# Altium schematic sheet MCU_STM32F411CE.SchDoc
size B; DrawnBy: M.Rex; Engineer: MR; Organization: Expatria Technologies; Address1: 1136 Glade Court; Address2: Port Coquitlam, BC V3B 1R5; Address3: CANADA; DocumentNumber: 3; SheetNumber: 3; SheetTotal: 13
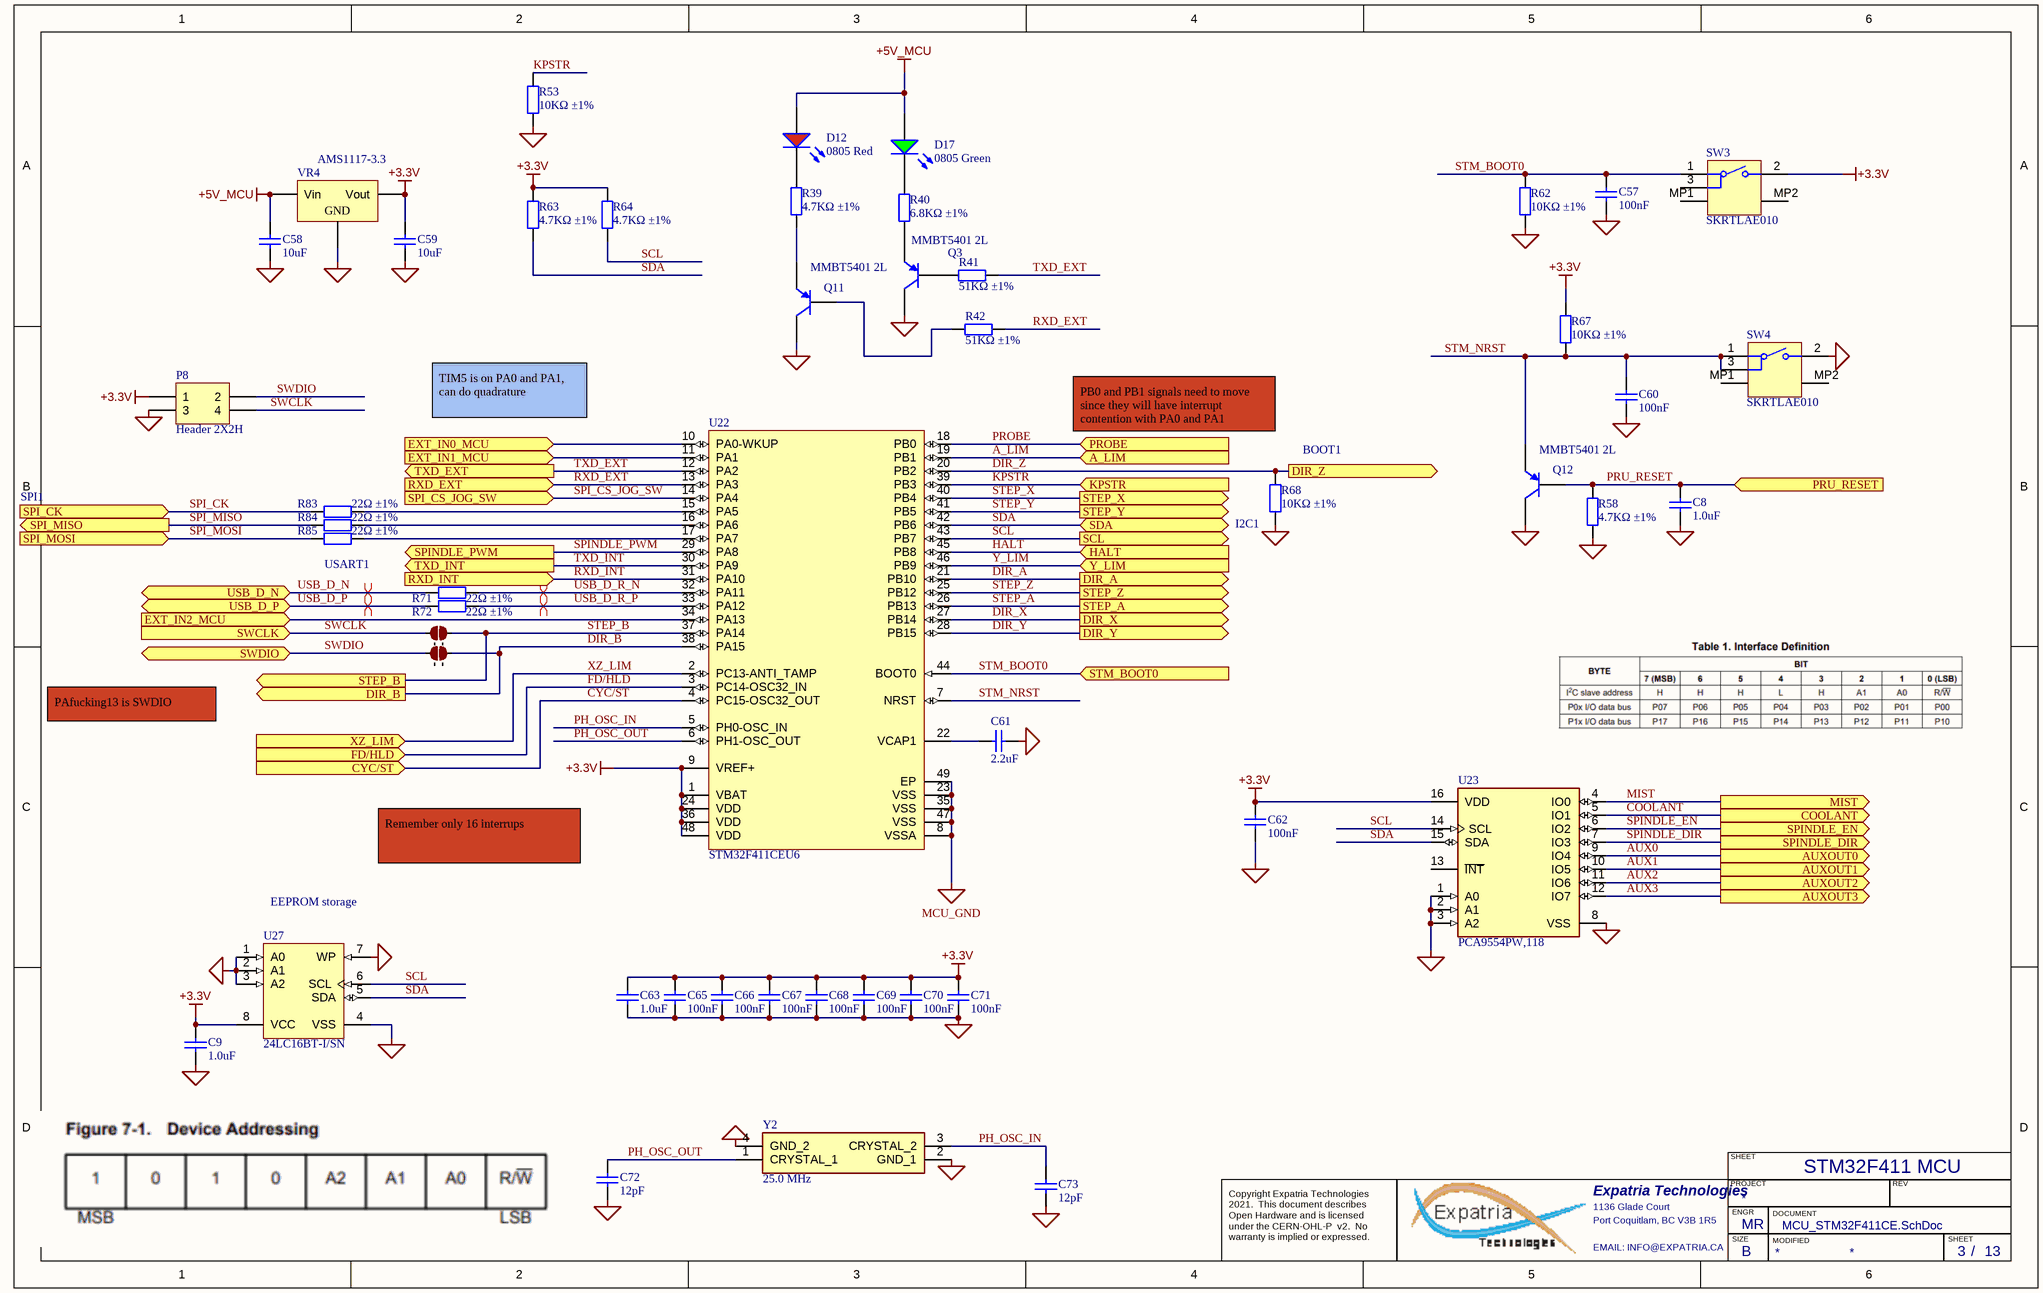
[diagram p0: MCU_STM32F411CE.SchDoc]

## Parts
C8  1.0uF  [0402_C]
C9  1.0uF  [0402_C]
C57  100nF  [0402_C]
C58  10uF  [1206_C]
C59  10uF  [1206_C]
C60  100nF  [0402_C]
C61  2.2uF  [0603_C]
C62  100nF  [0402_C]
C63  1.0uF  [0402_C]
C65  100nF  [0402_C]
C66  100nF  [0402_C]
C67  100nF  [0402_C]
C68  100nF  [0402_C]
C69  100nF  [0402_C]
C70  100nF  [0402_C]
C71  100nF  [0402_C]
C72  12pF  [0402_C]
C73  12pF  [0402_C]
D12  0805 Red  [0805_LED_S1]
D17  0805 Green  [0805_LED_S1]
J11  2 way net solder junction - Normally Open  [2waySolder_NO]  (value not drawn)  (no BOM)
J13  2 way net solder junction - Normally Open  [2waySolder_NO]  (value not drawn)  (no BOM)
P8  Header 2X2H  [HDR2X2H]
Q3  MMBT5401 2L  [SOT-23(SOT-23-3)]
Q11  MMBT5401 2L  [SOT-23(SOT-23-3)]
Q12  MMBT5401 2L  [SOT-23(SOT-23-3)]
R39  4.7KΩ ±1%  [0402_R]
R40  6.8KΩ ±1%  [0402_R]
R41  51KΩ ±1%  [0402_R]
R42  51KΩ ±1%  [0402_R]
R53  10KΩ ±1%  [0402_R]
R58  4.7KΩ ±1%  [0402_R]
R62  10KΩ ±1%  [0402_R]
R63  4.7KΩ ±1%  [0402_R]
R64  4.7KΩ ±1%  [0402_R]
R67  10KΩ ±1%  [0402_R]
R68  10KΩ ±1%  [0402_R]
R71  22Ω ±1%  [0402_R]
R72  22Ω ±1%  [0402_R]
R83  22Ω ±1%  [0402_R]
R84  22Ω ±1%  [0402_R]
R85  22Ω ±1%  [0402_R]
SW3  SKRTLAE010  [ALPS-SKRTLAE010_V]
SW4  SKRTLAE010  [ALPS-SKRTLAE010_V]
U22  STM32F411CEU6  [STM-UFQFPN48_M]
U23  PCA9554PW,118  [FP-SOT403-1-IPC_C]
U27  24LC16BT-I/SN  [SOIC-SN8_L]
VR4  AMS1117-3.3  [SOT-223]
Y2  25.0 MHz  [YSX321SL]

## Ports
A_LIM (in), AUXOUT0 (out), AUXOUT1 (out), AUXOUT2 (out), AUXOUT3 (out), COOLANT (out), CYC/ST (in), DIR_A (out), DIR_B (out), DIR_X (out), DIR_Y (out), DIR_Z (out), EXT_IN0_MCU (in), EXT_IN1_MCU (in), EXT_IN2_MCU (in), FD/HLD (in), HALT (in), KPSTR (in), MIST (out), PROBE (in), PRU_RESET (in), RXD_EXT (in), RXD_INT (in), SCL (out), SDA (bidir), SPI_CK (in), SPI_CS_JOG_SW (in), SPI_MISO (out), SPI_MOSI (in), SPINDLE_DIR (out), SPINDLE_EN (out), SPINDLE_PWM (out), STEP_A (out), STEP_B (out), STEP_X (out), STEP_Y (out), STEP_Z (out), STM_BOOT0 (in), SWCLK (in), SWDIO (bidir), TXD_EXT (out), TXD_INT (out), USB_D_N (bidir), USB_D_P (bidir), XZ_LIM (in), Y_LIM (in)

## Nets
+3.3V: C9.2 C59.2 C62.2 C63.2 C65.2 C66.2 C67.2 C68.2 C69.2 C70.2 C71.2 P8.1 R63.2 R64.2 R67.1 SW3.2 U22.1(VBAT) U22.9(VREF+) U22.24(VDD) U22.36(VDD) U22.48(VDD) U23.16(VDD) U27.8(VCC) VR4.2(Vout)
+5V_MCU: C58.2 D12.A D17.A VR4.3(Vin)
MCU_GND: C8.1 C9.1 C57.1 C58.1 C59.1 C60.1 C61.1 C62.1 C63.1 C65.1 C66.1 C67.1 C68.1 C69.1 C70.1 C71.1 C72.1 C73.1 P8.3 Q3.3(C) Q11.3(C) Q12.3(C) R53.1 R58.1 R62.2 R68.1 SW4.2 U22.8(VSSA) U22.23(VSS) U22.35(VSS) U22.47(VSS) U22.49(EP) U23.1(A0) U23.2(A1) U23.3(A2) U23.8(VSS) U27.1(A0) U27.2(A1) U27.3(A2) U27.4(VSS) U27.7(WP) VR4.1(GND) Y2.2(GND_1) Y2.4(GND_2)
A_LIM: U22.19(PB1) ; port A_LIM
AUX0: U23.9(IO4) ; port AUXOUT0
AUX1: U23.10(IO5) ; port AUXOUT1
AUX2: U23.11(IO6) ; port AUXOUT2
AUX3: U23.12(IO7) ; port AUXOUT3
COOLANT: U23.5(IO1) ; port COOLANT
CYC/ST: U22.4(PC15-OSC32_OUT) ; port CYC/ST
DIR_A: U22.21(PB10) ; port DIR_A
DIR_B: J13.2 U22.38(PA15) ; port DIR_B
DIR_X: U22.27(PB14) ; port DIR_X
DIR_Y: U22.28(PB15) ; port DIR_Y
DIR_Z: R68.2 U22.20(PB2) ; port DIR_Z
EXT_IN0_MCU: U22.10(PA0-WKUP) ; port EXT_IN0_MCU
EXT_IN1_MCU: U22.11(PA1) ; port EXT_IN1_MCU
EXT_IN2_MCU: U22.34(PA13) ; port EXT_IN2_MCU
FD/HLD: U22.3(PC14-OSC32_IN) ; port FD/HLD
HALT: U22.45(PB8) ; port HALT
KPSTR: R53.2 U22.39(PB3) ; port KPSTR
MIST: U23.4(IO0) ; port MIST
PH_OSC_IN: C73.2 U22.5(PH0-OSC_IN) Y2.3(CRYSTAL_2)
PH_OSC_OUT: C72.2 U22.6(PH1-OSC_OUT) Y2.1(CRYSTAL_1)
PROBE: U22.18(PB0) ; port PROBE
PRU_RESET: C8.2 Q12.1(B) R58.2 ; port PRU_RESET
RXD_EXT: R42.1 U22.13(PA3) ; port RXD_EXT
RXD_INT: U22.31(PA10) ; port RXD_INT
SCL: R64.1 U22.43(PB7) U23.14(SCL) U27.6(SCL) ; port SCL
SDA: R63.1 U22.42(PB6) U23.15(SDA) U27.5(SDA) ; port SDA
SPI_CK: R83.2 ; port SPI_CK
SPI_CS_JOG_SW: U22.14(PA4) ; port SPI_CS_JOG_SW
SPI_MISO: R84.2 ; port SPI_MISO
SPI_MOSI: R85.2 ; port SPI_MOSI
SPINDLE_DIR: U23.7(IO3) ; port SPINDLE_DIR
SPINDLE_EN: U23.6(IO2) ; port SPINDLE_EN
SPINDLE_PWM: U22.29(PA8) ; port SPINDLE_PWM
STEP_A: U22.26(PB13) ; port STEP_A
STEP_B: J11.2 U22.37(PA14) ; port STEP_B
STEP_X: U22.40(PB4) ; port STEP_X
STEP_Y: U22.41(PB5) ; port STEP_Y
STEP_Z: U22.25(PB12) ; port STEP_Z
STM_BOOT0: C57.2 R62.1 SW3.1 U22.44(BOOT0) ; port STM_BOOT0
STM_NRST: C60.2 Q12.2(E) R67.2 SW4.1 SW4.3 U22.7(NRST)
SWCLK: J11.1 P8.4 ; port SWCLK
SWDIO: J13.1 P8.2 ; port SWDIO
TXD_EXT: R41.2 U22.12(PA2) ; port TXD_EXT
TXD_INT: U22.30(PA9) ; port TXD_INT
USB_D_N: R71.2 ; port USB_D_N
USB_D_P: R72.2 ; port USB_D_P
USB_D_R_N: R71.1 U22.32(PA11)
USB_D_R_P: R72.1 U22.33(PA12)
XZ_LIM: U22.2(PC13-ANTI_TAMP) ; port XZ_LIM
Y_LIM: U22.46(PB9) ; port Y_LIM
NetC61_2: C61.2 U22.22(VCAP1)
NetD12_K: D12.K R39.2
NetD17_K: D17.K R40.2
NetQ3_1: Q3.1(B) R41.1
NetQ3_2: Q3.2(E) R40.1
NetQ11_1: Q11.1(B) R42.2
NetQ11_2: Q11.2(E) R39.1
NetR83_1: R83.1 U22.15(PA5)
NetR84_1: R84.1 U22.16(PA6)
NetR85_1: R85.1 U22.17(PA7)

Not connected (* = marked no-connect by the designer): SW3 3 MP1 MP2; SW4 MP1 MP2; U23 13(~{INT})

## Layout directives
differential pair: USB_D_N, USB_D_P, USB_D_R_N, USB_D_R_P

## Notes on the sheet
- TIM5 is on PA0 and PA1, can do quadrature
- PB0 and PB1 signals need to move since they will have interrupt contention with PA0 and PA1
- SPI1
- (near R68) BOOT1
- USART1
- (near R68) I2C1
- PAfucking13 is SWDIO
- (near U27) EEPROM storage
- Remember only 16 interrups
- STM32F411 MCU
- SHEET
- Expatria Technologies
- 1136 Glade Court
- Port Coquitlam, BC V3B 1R5
- PROJECT
- SIZE
- ENGR
- MODIFIED
- DOCUMENT
- REV
- Copyright Expatria Technologies 2021.  This document describes Open Hardware and is licensed under the CERN-OHL-P  v2.  No warranty is implied or expressed.
- EMAIL: INFO@EXPATRIA.CA
- B
- /

## Library data of the parts
C8 C9 C63 = 0402 1.0uF (105) 10% 25V: Chip capacitor; Manufacturer: Samsung Electro-Mechanics; PartNumber: CL05A105KA5NQNC; Capacitance: 1uF; Tolerance: 10%; Voltage: 25V; Package: 0402; Supplier: LC; SuppliersPartNumber: C52923
  C8 C63: ComponentLink1Description: Supplier link; ComponentLink1URL: http://www.szlcsc.com/product/details_53938.html
C57 C60 C62 C65-C71 = 0402 100nF (104) 10% 16V: Chip capacitors; Manufacturer: Samsung Electro-Mechanics; PartNumber: CL05B104KO5NNNC; Tolerance: 10%; Voltage: 16V; ComponentLink1Description: Supplier link; ComponentLink1URL: http://www.szlcsc.com/product/details_1877.html; Package: 0402; Supplier: LC; SuppliersPartNumber: C1525; Capacitance: 100nF
C58 C59 = 1206 10uF (106) 10% 50V: Chip capacitors; Manufacturer: Samsung Electro-Mechanics; PartNumber: CL31A106KBHNNNE; Tolerance: 10%; Voltage: 50V; ComponentLink1Description: Supplier link; ComponentLink1URL: http://www.szlcsc.com/product/details_14236.html; Package: 1206; Supplier: LC; SuppliersPartNumber: C13585; Capacitance: 10uF
C61 = 0603 2.2uF (225) 10% 16V: Chip capacitors; Manufacturer: Samsung Electro-Mechanics; PartNumber: CL10A225KO8NNNC; Tolerance: 10%; Voltage: 16V; ComponentLink1Description: Supplier link; ComponentLink1URL: http://www.szlcsc.com/product/details_24366.html; Package: 0603; Supplier: LC; SuppliersPartNumber: C23630; Capacitance: 2.2uF
C72 C73 = 0402 12pF (120) 5% 50V: Chip capacitors; Manufacturer: Guangdong Fenghua Advanced Tech; PartNumber: 0402CG120J500NT; Tolerance: 5%; Voltage: 50V; ComponentLink1Description: Supplier link; ComponentLink1URL: http://www.szlcsc.com/product/details_1899.html; Package: 0402; Supplier: LC; SuppliersPartNumber: C1547; Capacitance: 12pF
D12 = 0805 LED Red: LED; PartNumber: FC-2012HRK-620D; Manufacturer: Foshan NationStar Optoelectronics; ComponentLink1Description: 供应商链接; ComponentLink1URL: http://www.szlcsc.com/product/details_2668.html; Package: 0805; Supplier: LC; SuppliersPartNumber: C84256; Color: Red
D17 = 0805 LED Green: LED; ComponentLink1Description: 供应商链接; ComponentLink1URL: http://www.szlcsc.com/product/details_2670.html; Package: 0805; Supplier: LC; SuppliersPartNumber: C2297; Color: Green
J11 J13 = 2waySolderNO: ComponentLink1URL: http://www.edatools.cz/addons; ComponentLink1Description: Source
P8 = Header 2X2H: Header, 2-Pin, Dual row, Right Angle; LatestRevisionDate: 17-Jul-2002; LatestRevisionNote: Re-released for DXP Platform.; Publisher: Altium Limited
Q3 Q11 Q12 = SOT-23 MMBT5401 2L: 三极管; ComponentLink1Description: 供应商链接; ComponentLink1URL: http://www.szlcsc.com/product/details_8818.html; Package: SOT-23; Supplier: LC; SuppliersPartNumber: C8326
R39 R58 R63 R64 = 0402 4.7K (4701) 1%: Chip resistor; Manufacturer: Uniroyal Elec; PartNumber: 0402WGF4701TCE; Power: 1/16W; ComponentLink1Description: Supplier link; ComponentLink1URL: http://www.szlcsc.com/product/details_26643.html; Package: 0402; Supplier: LC; SuppliersPartNumber: C25900; Resistance: 4.7KΩ; Tolerance: 1%
R40 = 0402 6.8K (6801) 1%: Chip resistor; Manufacturer: Uniroyal Elec; PartNumber: 0402WGF6801TCE; Power: 1/16W; ComponentLink1Description: Supplier link; ComponentLink1URL: http://www.szlcsc.com/product/details_26660.html; Package: 0402; Supplier: LC; SuppliersPartNumber: C25917; Resistance: 6.8KΩ; Tolerance: 1%
R41 R42 = 0402 51K (5102) 1%: Chip resistor; Manufacturer: Uniroyal Elec; PartNumber: 0402WGF5102TCE; Power: 1/16W; ComponentLink1Description: Supplier link; ComponentLink1URL: http://www.szlcsc.com/product/details_26537.html; Package: 0402; Supplier: LC; SuppliersPartNumber: C25794; Resistance: 51KΩ; Tolerance: 1%
R53 R62 R67 R68 = 0402 10K (1002) 1%: Chip resistor; Manufacturer: Uniroyal Elec; PartNumber: 0402WGF1002TCE; Power: 1/16W; ComponentLink1Description: Supplier link; ComponentLink1URL: http://www.szlcsc.com/product/details_26487.html; Package: 0402; Supplier: LC; SuppliersPartNumber: C25744; Resistance: 10KΩ; Tolerance: 1%
R71 R72 R83-R85 = 0402 22R (22R0) 1%: Chip resistor; Manufacturer: Uniroyal Elec; PartNumber: 0402WGF220JTCE; Power: 1/16W; ComponentLink1Description: Supplier link; ComponentLink1URL: http://www.szlcsc.com/product/details_25835.html; Package: 0402; Supplier: LC; SuppliersPartNumber: C25092; Resistance: 22Ω; Tolerance: 1%
SW3 SW4 = CMP-2000-07073-2: Side Push Type, 250 V, -40 to 90 degC, 3-Pin SMD, RoHS, Tape and Reel; Manufacturer: ALPS; Operating Force: 1.6N; Folder: Unified Components\Components\New Releases\New\; Maximum Current Rating: 0.05@12VDCA; RevisionId: 1; Pole Throw Configuration: SPST; Switch Configuration: N.O.; AccessRights: 2147483647; Maximum DC Voltage Rating: 12V; ContentType: Unified Component; Rad Hard: No; Mounting: SurfaceMount; Datasheet URL: http://www.alps.com/prod/info/E/PDF/Tact/SurfaceMount/SKRT/SKRT.PDF; Manufacturer URL: http://www.alps.com/e/; ReleaseDate: 22/09/2017 06:13:25 AM; ItemHRID: CMP-2000-07073; ContentTypeGUID: CB3C11C4-E317-11DF-B822-12313F0024A2; LifeCycle: Released; ItemGUID: EAC55BEC-37DC-4BDB-8BA7-D75E6D5C3D75; Packaging: Tape&Reel; Package Reference: SKRTLAE010; FolderGUID: B7F4506A-9127-42E7-A087-46FE7B18D116; Datasheet Version: 06/2015; Mounting Technology: SurfaceMount; LifeCycleStateGUID: 61E382EE-6656-4F12-9E24-BE9327104A25; Package Description: 3-Pin Surface Mount Device, Body 4.5 x 3.55 mm, Pitch 1.225 mm; SuppliersPartNumber: C110293
U22 = STM32F411CEU6: ARM Cortex-M4 32-bit MCU+FPU, 512 KB Flash, 128 KB RAM, 36 I/Os, 48-Pin UFQFPN, -40 to 85 degC, Tray; Manufacturer 1: STMicroelectronics; Operating Frequency(F) (Processor speed) (MHz): 100; FLASH Size (Prog) (kB): 512; Internal RAM Size (kB): 128; I/Os (High Current): C60420; Supply Voltage(Vcc) min (V): 1.7; Package Reference: 48-Pin Ultra Thin Fine Pitch Quad Flat No-Lead, 7 x 7 x 0.6 mm Body, 0.5 mm Pitch, Exposed Pad; ComponentLink1Description: Manufacturer URL; ComponentLink1URL: http://www.st.com/; Packing: Tray; Package Description: UFQFPN48; Core: ARM Cortex-M4; ComponentLink2Description: Datasheet; ComponentLink2URL: http://www.st.com/st-web-ui/static/active/en/resource/technical/document/datasheet/DM00115249.pdf; DatasheetVersion: Rev. 6; Mounting Technology: Surface Mount; Manufacturer Part Number 1: STM32F411CEU6; SuppliersPartNumber: C60420
U23 = CMP-10112-000014-2: IC I/O EXPANDER I2C 8B 16TSSOP; Nominal Supply Current: 104uA; REACH SVHC: No SVHC; Lead Free: Lead Free; Number of Pins: 16; SuppliersPartNumber: C17230
U27 = CMP-0159-00216-1: IC EEPROM 16KBIT I2C 8SOIC; SuppliersPartNumber: C6480
VR4 = SOT-223 AMS1117-3.3: 低压差线性稳压(LDO); ComponentLink1Description: 供应商链接; ComponentLink1URL: http://www.szlcsc.com/product/details_6652.html; Package: SOT-223; Supplier: LC; SuppliersPartNumber: C6186
Y2 = YSX321SL: Crystal or Oscillator; Manufacturer_Name: Yangxing Tech; Manufacturer_Part_Number: X322525MSB4SI; Height: 0.8mm; SuppliersPartNumber: C13740